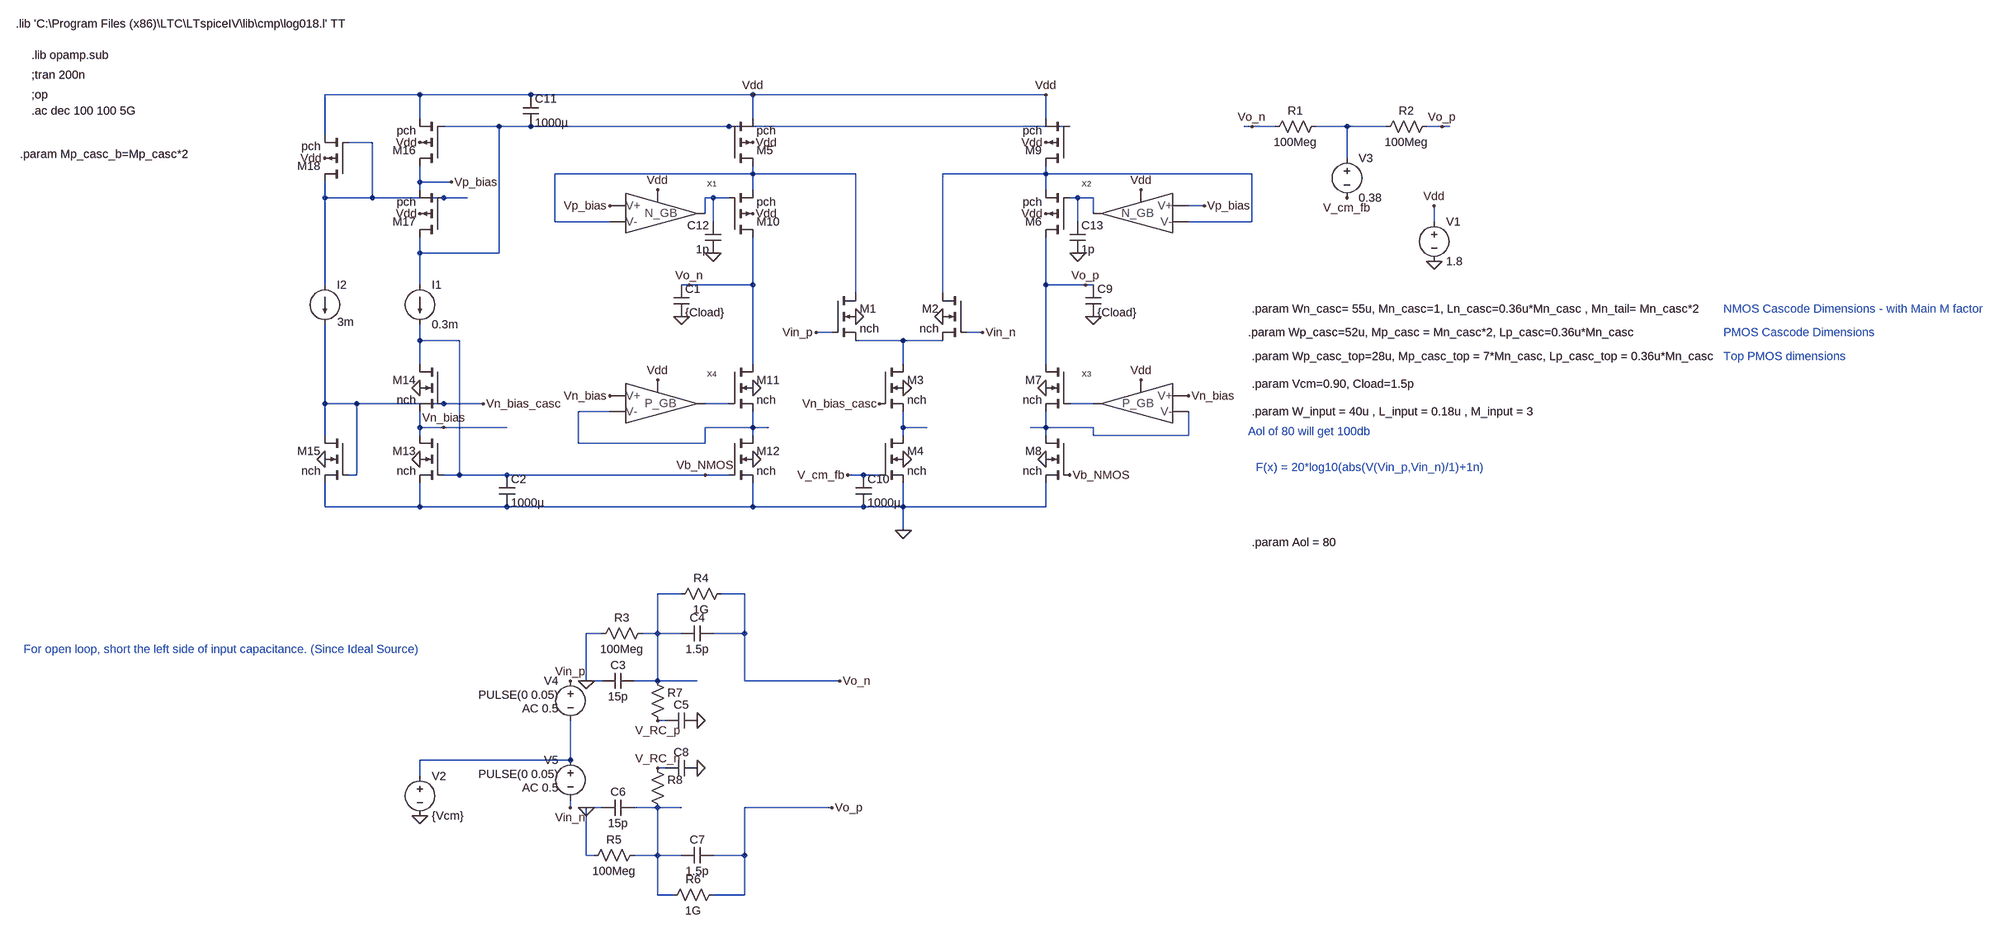
[diagram p0: schematic Discrete_Amplifier_10X.asc]
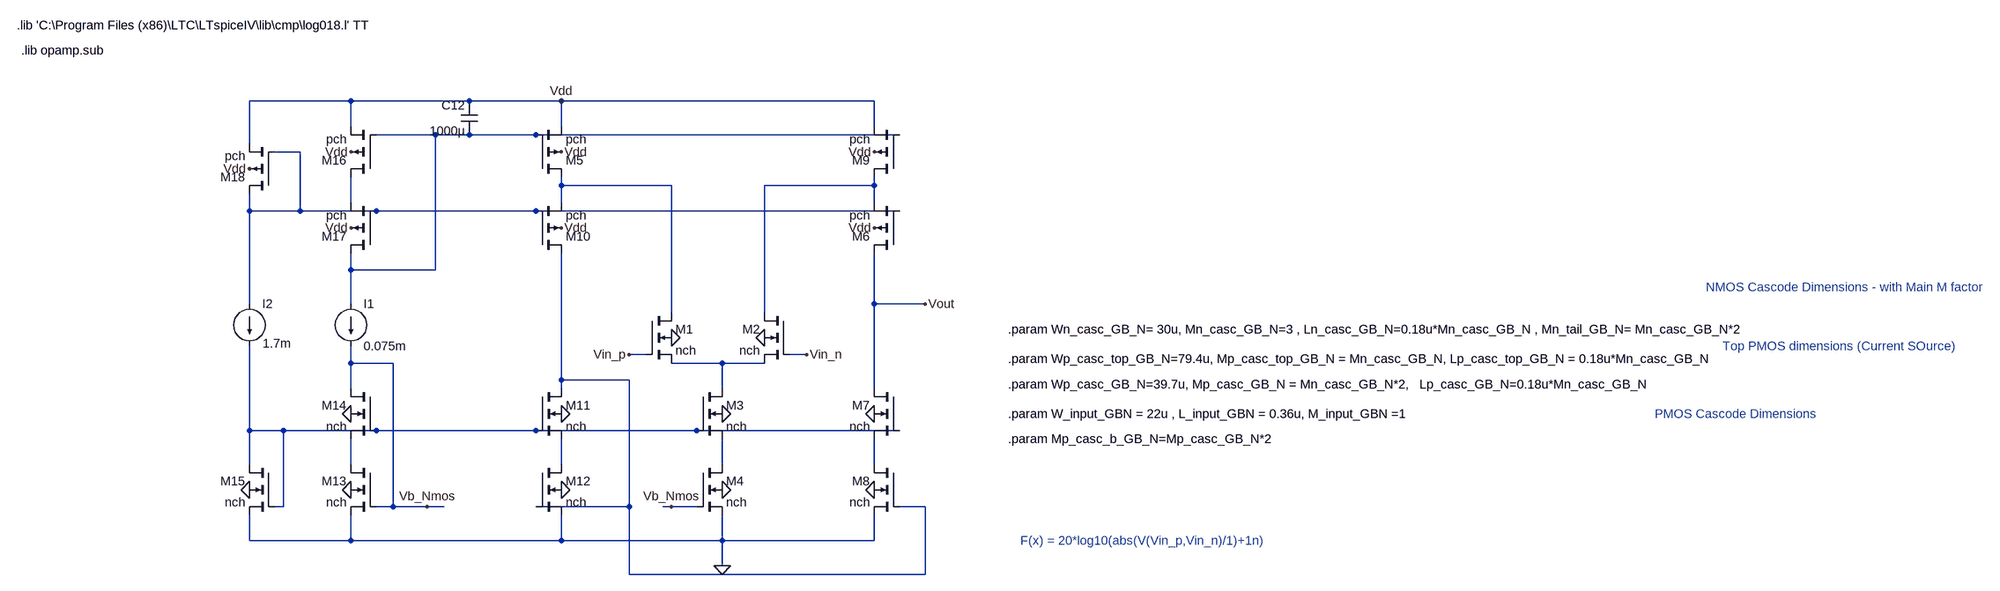
[diagram p1: sub-circuit gb-nmos.asc]
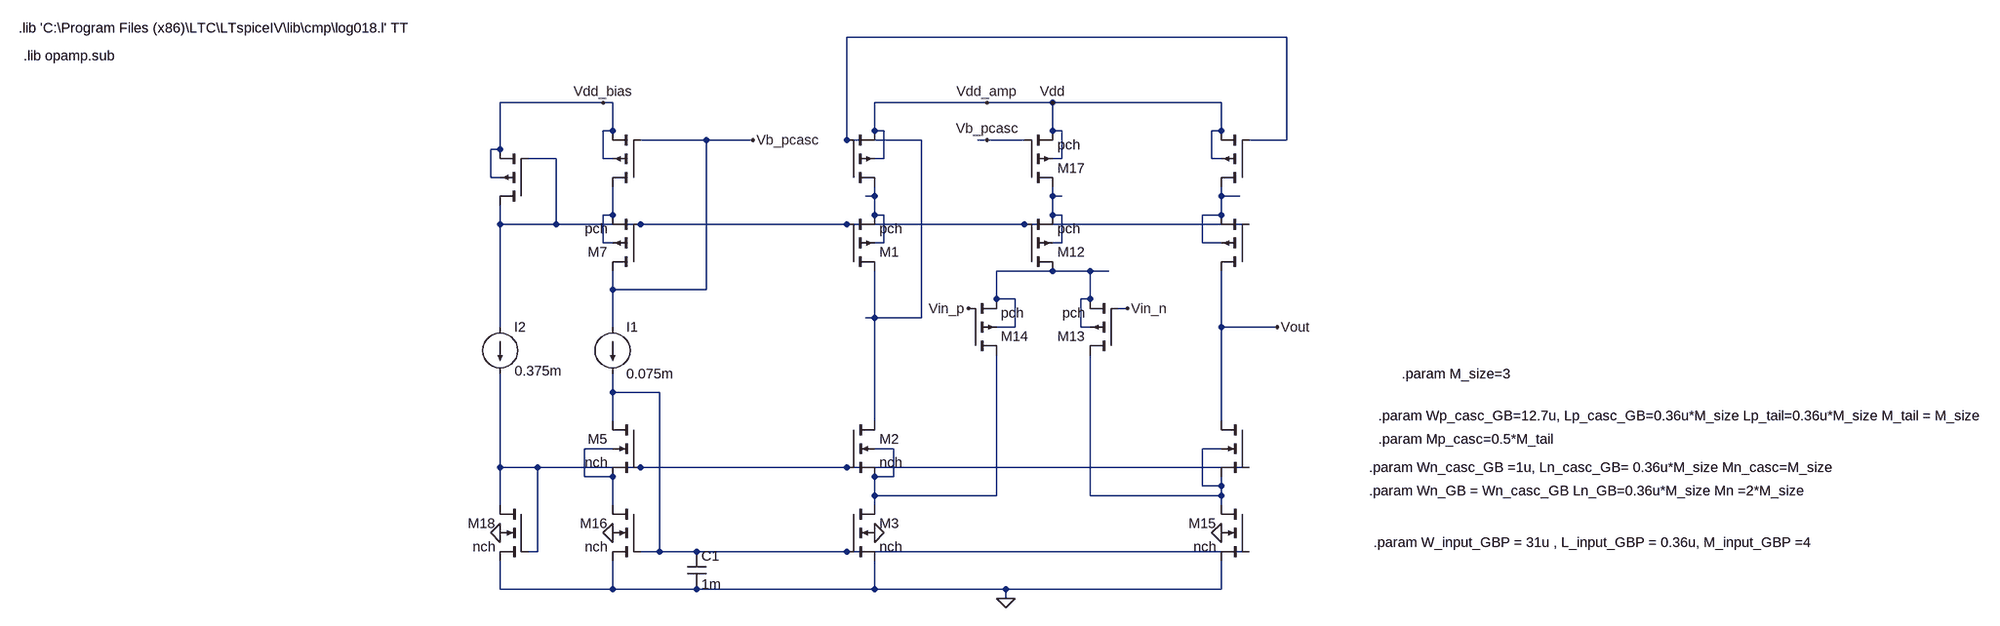
[diagram p2: sub-circuit gb-pmos.asc]
Discrete_Amplifier_10X.asc, the LTspice schematic file:
Version 4
SHEET 1 5520 2052
WIRE 208 -880 16 -880
WIRE 432 -880 208 -880
WIRE 880 -880 432 -880
WIRE 1376 -880 880 -880
WIRE 1472 -880 1376 -880
WIRE 208 -832 208 -880
WIRE 880 -832 880 -880
WIRE 1472 -832 1472 -880
WIRE 320 -816 256 -816
WIRE 368 -816 320 -816
WIRE 432 -816 368 -816
WIRE 832 -816 432 -816
WIRE 1520 -816 832 -816
WIRE 1888 -816 1872 -816
WIRE 1936 -816 1888 -816
WIRE 2064 -816 2016 -816
WIRE 2080 -816 2064 -816
WIRE 2160 -816 2080 -816
WIRE 2272 -816 2240 -816
WIRE 2288 -816 2272 -816
WIRE 16 -800 16 -880
WIRE 112 -784 64 -784
WIRE 2080 -752 2080 -816
WIRE 880 -720 880 -736
WIRE 880 -720 480 -720
WIRE 992 -720 880 -720
WIRE 1088 -720 992 -720
WIRE 1360 -720 1264 -720
WIRE 1472 -720 1472 -736
WIRE 1472 -720 1360 -720
WIRE 1888 -720 1472 -720
WIRE 208 -704 208 -736
WIRE 272 -704 208 -704
WIRE 208 -688 208 -704
WIRE 880 -688 880 -720
WIRE 1472 -688 1472 -720
WIRE 16 -672 16 -704
WIRE 112 -672 112 -784
WIRE 112 -672 16 -672
WIRE 256 -672 112 -672
WIRE 304 -672 256 -672
WIRE 800 -672 784 -672
WIRE 816 -672 800 -672
WIRE 832 -672 816 -672
WIRE 1536 -672 1520 -672
WIRE 1568 -672 1536 -672
WIRE 1792 -656 1760 -656
WIRE 784 -640 784 -672
WIRE 1568 -640 1568 -672
WIRE 480 -624 480 -720
WIRE 592 -624 480 -624
WIRE 800 -624 800 -672
WIRE 1536 -624 1536 -672
WIRE 1888 -624 1888 -720
WIRE 1888 -624 1760 -624
WIRE 2256 -624 2256 -656
WIRE 1088 -608 1088 -720
WIRE 1264 -608 1264 -720
WIRE 208 -560 208 -592
WIRE 368 -560 368 -816
WIRE 368 -560 208 -560
WIRE 880 -560 880 -592
WIRE 1472 -560 1472 -592
WIRE 16 -496 16 -672
WIRE 208 -496 208 -560
WIRE 752 -496 736 -496
WIRE 880 -496 880 -560
WIRE 880 -496 752 -496
WIRE 1472 -496 1472 -560
WIRE 1552 -496 1472 -496
WIRE 1568 -496 1552 -496
WIRE 1088 -480 1088 -608
WIRE 1264 -480 1264 -608
WIRE 1040 -400 1008 -400
WIRE 1344 -400 1312 -400
WIRE 208 -384 208 -416
WIRE 288 -384 208 -384
WIRE 1184 -384 1088 -384
WIRE 1264 -384 1184 -384
WIRE 208 -336 208 -384
WIRE 880 -336 880 -496
WIRE 1184 -336 1184 -384
WIRE 1472 -336 1472 -496
WIRE 16 -256 16 -416
WIRE 80 -256 16 -256
WIRE 256 -256 80 -256
WIRE 336 -256 256 -256
WIRE 832 -256 784 -256
WIRE 1568 -256 1520 -256
WIRE 592 -240 528 -240
WIRE 208 -208 208 -240
WIRE 256 -208 208 -208
WIRE 384 -208 256 -208
WIRE 880 -208 880 -240
WIRE 880 -208 784 -208
WIRE 912 -208 880 -208
WIRE 1184 -208 1184 -240
WIRE 1232 -208 1184 -208
WIRE 1472 -208 1472 -240
WIRE 1472 -208 1440 -208
WIRE 1568 -208 1472 -208
WIRE 16 -192 16 -256
WIRE 208 -192 208 -208
WIRE 880 -192 880 -208
WIRE 1184 -192 1184 -208
WIRE 1472 -192 1472 -208
WIRE 1568 -192 1568 -208
WIRE 1760 -192 1760 -240
WIRE 1760 -192 1568 -192
WIRE 528 -176 528 -240
WIRE 784 -176 784 -208
WIRE 784 -176 528 -176
WIRE 80 -112 80 -256
WIRE 80 -112 64 -112
WIRE 288 -112 288 -384
WIRE 288 -112 256 -112
WIRE 384 -112 288 -112
WIRE 784 -112 384 -112
WIRE 832 -112 784 -112
WIRE 1104 -112 1072 -112
WIRE 1136 -112 1104 -112
WIRE 16 -48 16 -96
WIRE 208 -48 208 -96
WIRE 208 -48 16 -48
WIRE 384 -48 208 -48
WIRE 880 -48 880 -96
WIRE 880 -48 384 -48
WIRE 1104 -48 880 -48
WIRE 1184 -48 1184 -96
WIRE 1184 -48 1104 -48
WIRE 1472 -48 1472 -96
WIRE 1472 -48 1184 -48
WIRE 1184 0 1184 -48
WIRE 736 128 688 128
WIRE 864 128 816 128
WIRE 576 208 544 208
WIRE 688 208 688 128
WIRE 688 208 656 208
WIRE 736 208 688 208
WIRE 864 208 864 128
WIRE 864 208 800 208
WIRE 544 304 544 208
WIRE 576 304 544 304
WIRE 688 304 688 208
WIRE 688 304 640 304
WIRE 768 304 688 304
WIRE 864 304 864 208
WIRE 1056 304 864 304
WIRE 704 384 688 384
WIRE 512 464 512 384
WIRE 512 464 208 464
WIRE 704 480 688 480
WIRE 208 496 208 464
WIRE 512 560 512 544
WIRE 576 560 544 560
WIRE 688 560 640 560
WIRE 736 560 688 560
WIRE 1040 560 864 560
WIRE 544 656 544 560
WIRE 560 656 544 656
WIRE 688 656 688 560
WIRE 688 656 640 656
WIRE 736 656 688 656
WIRE 864 656 864 560
WIRE 864 656 800 656
WIRE 688 736 688 656
WIRE 720 736 688 736
WIRE 864 736 864 656
WIRE 864 736 800 736
FLAG 1088 -432 0
FLAG 1184 -288 0
FLAG 1184 -144 0
FLAG 1184 0 0
FLAG 880 -288 0
FLAG 880 -144 0
FLAG 2256 -544 0
FLAG 2256 -656 Vdd
FLAG 880 -880 Vdd
FLAG 880 -640 Vdd
FLAG 880 -784 Vdd
FLAG 208 -144 0
FLAG 16 -144 0
FLAG 208 -288 0
FLAG 208 -784 Vdd
FLAG 208 -640 Vdd
FLAG 16 -752 Vdd
FLAG 1264 -432 0
FLAG 1472 -288 0
FLAG 1472 -144 0
FLAG 1472 -880 Vdd
FLAG 1472 -640 Vdd
FLAG 1472 -784 Vdd
FLAG 1072 -112 V_cm_fb
FLAG 1008 -400 Vin_p
FLAG 1344 -400 Vin_n
FLAG 208 576 0
FLAG 752 -496 Vo_n
FLAG 1552 -496 Vo_p
FLAG 2272 -816 Vo_p
FLAG 1888 -816 Vo_n
FLAG 1568 -432 0
FLAG 736 -432 0
FLAG 1056 304 Vo_n
FLAG 1040 560 Vo_p
FLAG 512 304 Vin_p
FLAG 512 560 Vin_n
FLAG 768 384 0
FLAG 768 480 0
FLAG 688 384 V_RC_p
FLAG 688 480 V_RC_n
FLAG 784 -112 Vb_NMOS
FLAG 1520 -112 Vb_NMOS
FLAG 2080 -672 V_cm_fb
FLAG 256 -208 Vn_bias
FLAG 336 -256 Vn_bias_casc
FLAG 1136 -256 Vn_bias_casc
FLAG 272 -704 Vp_bias
FLAG 688 -688 Vdd
FLAG 592 -656 Vp_bias
FLAG 1664 -688 Vdd
FLAG 1792 -656 Vp_bias
FLAG 592 -272 Vn_bias
FLAG 688 -304 Vdd
FLAG 1664 -304 Vdd
FLAG 1760 -272 Vn_bias
FLAG 544 304 0
FLAG 544 560 0
FLAG 800 -560 0
FLAG 1536 -560 0
DATAFLAG 912 -208 "round($*10k)/10k"
DATAFLAG 1184 -384 "round($*10k)/10k"
DATAFLAG 1232 -208 "round($*10k)/10k"
DATAFLAG 992 -720 "round($*100)/100"
DATAFLAG 1440 -208 "round($*10k)/10k"
DATAFLAG 1360 -720 "round($*100)/100"
DATAFLAG 1376 -880 "round($*1k)/1k"
DATAFLAG 1472 -560 "round($*1k)/1k"
DATAFLAG 1088 -608 "Id(M1)"
DATAFLAG 2064 -816 ""
DATAFLAG 320 -816 "round($*100)/100"
DATAFLAG 304 -672 "round($*10k)/10k"
DATAFLAG 384 -112 "round($*10k)/10k"
DATAFLAG 816 -368 "Id(M11)"
DATAFLAG 960 -832 "-Id(M5)"
DATAFLAG 1104 -208 "Id(M4)"
DATAFLAG 1104 -112 "round($*10k)/10k"
DATAFLAG 384 -208 "round($*10k)/10k"
DATAFLAG 208 -704 "round($*10k)/10k"
DATAFLAG 1264 -608 "Id(M1)"
DATAFLAG 816 -672 ""
DATAFLAG 1536 -672 ""
DATAFLAG 880 -560 "round($*1k)/1k"
SYMBOL nmos4 1040 -480 R0
SYMATTR InstName M1
SYMATTR Value nch
SYMATTR Value2 l={L_input} w={W_input} m={M_input}
SYMBOL nmos4 1136 -336 R0
SYMATTR InstName M3
SYMATTR Value nch
SYMATTR Value2 l={Ln_casc} w={Wn_casc} m={Mn_tail}
SYMBOL nmos4 1136 -192 R0
SYMATTR InstName M4
SYMATTR Value nch
SYMATTR Value2 l={Ln_casc} w={Wn_casc} m={Mn_tail}
SYMBOL pmos4 832 -592 M180
SYMATTR InstName M10
SYMATTR Value pch
SYMATTR Value2 l={Lp_casc} w={Wp_casc} m={Mp_casc}
SYMBOL nmos4 832 -336 R0
SYMATTR InstName M11
SYMATTR Value nch
SYMATTR Value2 l={Ln_casc} w={Wn_casc} m={Mn_casc}
SYMBOL nmos4 832 -192 R0
SYMATTR InstName M12
SYMATTR Value nch
SYMATTR Value2 l={Ln_casc} w={Wn_casc} m={Mn_casc}
SYMBOL voltage 2256 -640 R0
WINDOW 123 0 0 Left 2
WINDOW 39 0 0 Left 2
SYMATTR InstName V1
SYMATTR Value 1.8
SYMBOL pmos4 832 -736 M180
SYMATTR InstName M5
SYMATTR Value pch
SYMATTR Value2 l={Lp_casc_top} w={Wp_casc_top} m={Mp_casc_top}
SYMBOL res 2032 -832 R90
WINDOW 0 0 56 VBottom 2
WINDOW 3 32 56 VTop 2
SYMATTR InstName R1
SYMATTR Value 100Meg
SYMBOL res 2256 -832 R90
WINDOW 0 0 56 VBottom 2
WINDOW 3 32 56 VTop 2
SYMATTR InstName R2
SYMATTR Value 100Meg
SYMBOL nmos4 256 -192 M0
SYMATTR InstName M13
SYMATTR Value nch
SYMATTR Value2 l={Ln_casc} w={Wn_casc} m={Mn_tail}
SYMBOL current 208 -496 R0
WINDOW 123 0 0 Left 2
WINDOW 39 0 0 Left 2
SYMATTR InstName I1
SYMATTR Value 0.3m
SYMBOL nmos4 256 -336 M0
SYMATTR InstName M14
SYMATTR Value nch
SYMATTR Value2 l={Ln_casc} w={Wn_casc} m={Mn_tail}
SYMBOL current 16 -496 R0
WINDOW 123 0 0 Left 2
WINDOW 39 0 0 Left 2
WINDOW 3 25 75 Left 2
SYMATTR Value 3m
SYMATTR InstName I2
SYMBOL nmos4 64 -192 M0
SYMATTR InstName M15
SYMATTR Value nch
SYMATTR Value2 l={Ln_casc} w={Wn_casc} m={Mn_tail}
SYMBOL pmos4 256 -736 R180
SYMATTR InstName M16
SYMATTR Value pch
SYMATTR Value2 l={Lp_casc_top} w={Wp_casc_top} m={Mp_casc_top}
SYMBOL pmos4 256 -592 R180
SYMATTR InstName M17
SYMATTR Value pch
SYMATTR Value2 l={Lp_casc} w={Wp_casc} m={Mp_casc}
SYMBOL pmos4 64 -704 R180
SYMATTR InstName M18
SYMATTR Value pch
SYMATTR Value2 l={Lp_casc} w={Wp_casc} m={Mp_casc_b}
SYMBOL nmos4 1312 -480 M0
SYMATTR InstName M2
SYMATTR Value nch
SYMATTR Value2 l={L_input} w={W_input} m={M_input}
SYMBOL pmos4 1520 -592 R180
SYMATTR InstName M6
SYMATTR Value pch
SYMATTR Value2 l={Lp_casc} w={Wp_casc} m={Mp_casc}
SYMBOL nmos4 1520 -336 M0
SYMATTR InstName M7
SYMATTR Value nch
SYMATTR Value2 l={Ln_casc} w={Wn_Casc} m={Mn_casc}
SYMBOL nmos4 1520 -192 M0
SYMATTR InstName M8
SYMATTR Value nch
SYMATTR Value2 l={Ln_casc} w={Wn_Casc} m={Mn_casc}
SYMBOL pmos4 1520 -736 R180
SYMATTR InstName M9
SYMATTR Value pch
SYMATTR Value2 l={Lp_casc_top} w={Wp_casc_top} m={Mp_casc_top}
SYMBOL cap 368 -112 R0
SYMATTR InstName C2
SYMATTR Value 1000µ
SYMBOL cap 640 288 R90
WINDOW 0 0 32 VBottom 2
WINDOW 3 32 32 VTop 2
SYMATTR InstName C3
SYMATTR Value 15p
SYMBOL cap 800 192 R90
WINDOW 0 0 32 VBottom 2
WINDOW 3 32 32 VTop 2
SYMATTR InstName C4
SYMATTR Value 1.5p
SYMBOL cap 640 576 M270
WINDOW 0 32 32 VTop 2
WINDOW 3 0 32 VBottom 2
SYMATTR InstName C6
SYMATTR Value 15p
SYMBOL cap 800 672 M270
WINDOW 0 32 32 VTop 2
WINDOW 3 0 32 VBottom 2
SYMATTR InstName C7
SYMATTR Value 1.5p
SYMBOL voltage 208 480 R0
WINDOW 123 0 0 Left 2
WINDOW 39 0 0 Left 2
SYMATTR InstName V2
SYMATTR Value {Vcm}
SYMBOL voltage 512 288 M0
WINDOW 3 24 44 Left 2
WINDOW 123 24 72 Left 2
WINDOW 39 0 0 Left 2
SYMATTR Value PULSE(0 0.05)
SYMATTR Value2 AC 0.5
SYMATTR InstName V4
SYMBOL voltage 512 448 M0
WINDOW 3 24 44 Left 2
WINDOW 123 24 72 Left 2
WINDOW 39 0 0 Left 2
SYMATTR Value PULSE(0 0.05)
SYMATTR Value2 AC 0.5
SYMATTR InstName V5
SYMBOL res 672 192 R90
WINDOW 0 0 56 VBottom 2
WINDOW 3 32 56 VTop 2
SYMATTR InstName R3
SYMATTR Value 100Meg
SYMBOL res 832 112 R90
WINDOW 0 0 56 VBottom 2
WINDOW 3 32 56 VTop 2
SYMATTR InstName R4
SYMATTR Value 1G
SYMBOL res 656 640 R90
WINDOW 0 0 56 VBottom 2
WINDOW 3 32 56 VTop 2
SYMATTR InstName R5
SYMATTR Value 100Meg
SYMBOL res 816 720 R90
WINDOW 0 0 56 VBottom 2
WINDOW 3 32 56 VTop 2
SYMATTR InstName R6
SYMATTR Value 1G
SYMBOL cap 720 -496 R0
SYMATTR InstName C1
SYMATTR Value {Cload}
SYMBOL cap 1552 -496 R0
SYMATTR InstName C9
SYMATTR Value {Cload}
SYMBOL res 672 288 R0
WINDOW 3 151 69 Invisible 2
SYMATTR Value 10Meg
SYMATTR InstName R7
SYMBOL res 672 464 R0
WINDOW 3 36 76 Invisible 2
SYMATTR Value 10Meg
SYMATTR InstName R8
SYMBOL cap 768 368 R90
WINDOW 0 0 32 VBottom 2
WINDOW 3 32 32 Invisible 2
SYMATTR InstName C5
SYMATTR Value 1000µ
SYMBOL cap 704 496 R270
WINDOW 0 32 32 VTop 2
WINDOW 3 0 32 Invisible 2
SYMATTR InstName C8
SYMATTR Value 1000µ
SYMBOL cap 1088 -112 R0
SYMATTR InstName C10
SYMATTR Value 1000µ
SYMBOL voltage 2080 -768 R0
WINDOW 123 0 0 Left 2
WINDOW 39 0 0 Left 2
SYMATTR InstName V3
SYMATTR Value 0.38
SYMBOL cap 416 -880 R0
SYMATTR InstName C11
SYMATTR Value 1000µ
SYMBOL GB-NMOS 688 -640 R0
SYMATTR InstName X1
SYMBOL GB-NMOS 1664 -640 M0
SYMATTR InstName X2
SYMBOL GB-PMOS 1664 -256 M0
SYMATTR InstName X3
SYMBOL GB-PMOS 688 -256 R0
SYMATTR InstName X4
SYMBOL cap 816 -560 R180
WINDOW 0 24 56 Left 2
WINDOW 3 24 8 Left 2
SYMATTR InstName C12
SYMATTR Value 1p
SYMBOL cap 1520 -624 R0
SYMATTR InstName C13
SYMATTR Value 1p
TEXT -608 -1024 Left 2 !.lib 'C:\\Program Files (x86)\\LTC\\LTspiceIV\\lib\\cmp\\log018.l' TT
TEXT -576 -920 Left 2 !;tran 200n
TEXT -576 -960 Left 2 !.lib opamp.sub
TEXT -576 -880 Left 2 !;op
TEXT -576 -848 Left 2 !.ac dec 100 100 5G
TEXT 1888 -448 Left 2 !.param Wn_casc= 55u, Mn_casc=1, Ln_casc=0.36u*Mn_casc , Mn_tail= Mn_casc*2
TEXT 1880 -400 Left 2 !.param Wp_casc=52u, Mp_casc = Mn_casc*2, Lp_casc=0.36u*Mn_casc
TEXT 1888 -352 Left 2 !.param Wp_casc_top=28u, Mp_casc_top = 7*Mn_casc, Lp_casc_top = 0.36u*Mn_casc
TEXT 1888 -296 Left 2 !.param Vcm=0.90, Cload=1.5p
TEXT 1896 -128 Left 2 ;F(x) = 20*log10(abs(V(Vin_p,Vin_n)/1)+1n)
TEXT 2840 -352 Left 2 ;Top PMOS dimensions
TEXT 2840 -400 Left 2 ;PMOS Cascode Dimensions
TEXT 2840 -448 Left 2 ;NMOS Cascode Dimensions - with Main M factor
TEXT -600 -760 Left 2 !.param Mp_casc_b=Mp_casc*2
TEXT 1888 24 Left 2 !.param Aol = 80
TEXT -592 240 Left 2 ;For open loop, short the left side of input capacitance. (Since Ideal Source)
TEXT 1880 -200 Left 2 ;Aol of 80 will get 100db
TEXT 1888 -240 Left 2 !.param W_input = 40u , L_input = 0.18u , M_input = 3

gb-nmos.asc, the sub-circuit schematic file:
Version 4
SHEET 1 3836 784
WIRE 432 -880 240 -880
WIRE 656 -880 432 -880
WIRE 880 -880 656 -880
WIRE 1376 -880 880 -880
WIRE 1472 -880 1376 -880
WIRE 880 -848 880 -880
WIRE 432 -832 432 -880
WIRE 880 -832 880 -848
WIRE 1472 -832 1472 -880
WIRE 592 -816 480 -816
WIRE 656 -816 592 -816
WIRE 832 -816 656 -816
WIRE 1520 -816 832 -816
WIRE 240 -800 240 -880
WIRE 336 -784 288 -784
WIRE 880 -720 880 -736
WIRE 1088 -720 880 -720
WIRE 1472 -720 1472 -736
WIRE 1472 -720 1264 -720
WIRE 432 -688 432 -736
WIRE 880 -688 880 -720
WIRE 1472 -688 1472 -720
WIRE 240 -672 240 -704
WIRE 336 -672 336 -784
WIRE 336 -672 240 -672
WIRE 480 -672 336 -672
WIRE 704 -672 480 -672
WIRE 832 -672 704 -672
WIRE 1520 -672 832 -672
WIRE 432 -560 432 -592
WIRE 592 -560 592 -816
WIRE 592 -560 432 -560
WIRE 1472 -560 1472 -592
WIRE 240 -496 240 -672
WIRE 432 -496 432 -560
WIRE 1472 -496 1472 -560
WIRE 1568 -496 1472 -496
WIRE 1088 -480 1088 -720
WIRE 1264 -480 1264 -720
WIRE 880 -464 880 -592
WIRE 1040 -400 1008 -400
WIRE 1344 -400 1312 -400
WIRE 432 -384 432 -416
WIRE 512 -384 432 -384
WIRE 1184 -384 1088 -384
WIRE 1264 -384 1184 -384
WIRE 880 -352 880 -464
WIRE 1008 -352 880 -352
WIRE 432 -336 432 -384
WIRE 880 -336 880 -352
WIRE 1184 -336 1184 -384
WIRE 1472 -336 1472 -496
WIRE 240 -256 240 -416
WIRE 304 -256 240 -256
WIRE 480 -256 304 -256
WIRE 832 -256 480 -256
WIRE 1136 -256 832 -256
WIRE 1360 -256 1136 -256
WIRE 1520 -256 1360 -256
WIRE 240 -192 240 -256
WIRE 432 -192 432 -240
WIRE 880 -192 880 -240
WIRE 1184 -192 1184 -240
WIRE 1472 -192 1472 -240
WIRE 304 -112 304 -256
WIRE 304 -112 288 -112
WIRE 512 -112 512 -384
WIRE 512 -112 480 -112
WIRE 576 -112 512 -112
WIRE 608 -112 576 -112
WIRE 1008 -112 1008 -352
WIRE 1008 -112 832 -112
WIRE 1088 -112 1072 -112
WIRE 1136 -112 1088 -112
WIRE 1568 -112 1520 -112
WIRE 240 -48 240 -96
WIRE 432 -48 432 -96
WIRE 432 -48 240 -48
WIRE 880 -48 880 -96
WIRE 880 -48 432 -48
WIRE 1184 -48 1184 -96
WIRE 1184 -48 880 -48
WIRE 1472 -48 1472 -96
WIRE 1472 -48 1184 -48
WIRE 1184 0 1184 -48
WIRE 1008 16 1008 -112
WIRE 1456 16 1008 16
WIRE 1568 16 1568 -112
WIRE 1568 16 1456 16
FLAG 1088 -432 0
FLAG 1184 -288 0
FLAG 1184 -144 0
FLAG 1184 0 0
FLAG 880 -288 0
FLAG 880 -144 0
FLAG 880 -880 Vdd
FLAG 880 -640 Vdd
FLAG 880 -784 Vdd
FLAG 432 -144 0
FLAG 240 -144 0
FLAG 432 -288 0
FLAG 432 -784 Vdd
FLAG 432 -640 Vdd
FLAG 240 -752 Vdd
FLAG 1264 -432 0
FLAG 1472 -288 0
FLAG 1472 -144 0
FLAG 1472 -640 Vdd
FLAG 1472 -784 Vdd
FLAG 1008 -400 Vin_p
FLAG 1344 -400 Vin_n
FLAG 576 -112 Vb_Nmos
FLAG 1088 -112 Vb_Nmos
FLAG 1568 -496 Vout
DATAFLAG 1184 -384 "round($*10k)/10k"
DATAFLAG 1376 -880 "round($*1k)/1k"
DATAFLAG 1472 -560 "round($*1k)/1k"
DATAFLAG 704 -672 ""
DATAFLAG 1360 -256 ""
DATAFLAG 1456 16 ""
DATAFLAG 880 -848 "-Id(x1:M5)"
DATAFLAG 880 -464 "-Id(x1:M10)"
DATAFLAG 1168 -608 "Id(x2:M1)"
DATAFLAG 1168 -560 "Id(x1:M1)"
SYMBOL nmos4 1040 -480 R0
SYMATTR InstName M1
SYMATTR Value nch
SYMATTR Value2 l={L_input_GBN} w={W_input_GBN} m={M_input_GBN}
SYMBOL nmos4 1136 -336 R0
SYMATTR InstName M3
SYMATTR Value nch
SYMATTR Value2 l={Ln_casc_GB_N} w={Wn_casc_GB_N} m={Mn_tail_GB_N}
SYMBOL nmos4 1136 -192 R0
SYMATTR InstName M4
SYMATTR Value nch
SYMATTR Value2 l={Ln_casc_GB_N} w={Wn_casc_GB_N} m={Mn_tail_GB_N}
SYMBOL pmos4 832 -592 M180
SYMATTR InstName M10
SYMATTR Value pch
SYMATTR Value2 l={Lp_casc_GB_N} w={Wp_casc_GB_N} m={Mp_casc_GB_N}
SYMBOL nmos4 832 -336 R0
SYMATTR InstName M11
SYMATTR Value nch
SYMATTR Value2 l={Ln_casc_GB_N} w={Wn_casc_GB_N} m={Mn_casc_GB_N}
SYMBOL nmos4 832 -192 R0
SYMATTR InstName M12
SYMATTR Value nch
SYMATTR Value2 l={Ln_casc_GB_N} w={Wn_casc_GB_N} m={Mn_casc_GB_N}
SYMBOL pmos4 832 -736 M180
SYMATTR InstName M5
SYMATTR Value pch
SYMATTR Value2 l={Lp_casc_top_GB_N} w={Wp_casc_top_GB_N} m={Mp_casc_top_GB_N}
SYMBOL nmos4 480 -192 M0
SYMATTR InstName M13
SYMATTR Value nch
SYMATTR Value2 l={Ln_casc_GB_N} w={Wn_casc_GB_N} m={Mn_tail_GB_N}
SYMBOL current 432 -496 R0
WINDOW 123 0 0 Left 2
WINDOW 39 0 0 Left 2
SYMATTR InstName I1
SYMATTR Value 0.075m
SYMBOL nmos4 480 -336 M0
SYMATTR InstName M14
SYMATTR Value nch
SYMATTR Value2 l={Ln_casc_GB_N} w={Wn_casc_GB_N} m={Mn_tail_GB_N}
SYMBOL current 240 -496 R0
WINDOW 123 0 0 Left 2
WINDOW 39 0 0 Left 2
WINDOW 3 25 75 Left 2
SYMATTR Value 1.7m
SYMATTR InstName I2
SYMBOL nmos4 288 -192 M0
SYMATTR InstName M15
SYMATTR Value nch
SYMATTR Value2 l={Ln_casc_GB_N} w={Wn_casc_GB_N} m={Mn_tail_GB_N}
SYMBOL pmos4 480 -736 R180
SYMATTR InstName M16
SYMATTR Value pch
SYMATTR Value2 l={Lp_casc_top_GB_N} w={Wp_casc_top_GB_N} m={Mp_casc_top_GB_N}
SYMBOL pmos4 480 -592 R180
SYMATTR InstName M17
SYMATTR Value pch
SYMATTR Value2 l={Lp_casc_GB_N} w={Wp_casc_GB_N} m={Mp_casc_GB_N}
SYMBOL pmos4 288 -704 R180
SYMATTR InstName M18
SYMATTR Value pch
SYMATTR Value2 l={Lp_casc_GB_N} w={Wp_casc_GB_N} m={Mp_casc_b_GB_N}
SYMBOL nmos4 1312 -480 M0
SYMATTR InstName M2
SYMATTR Value nch
SYMATTR Value2 l={L_input_GBN} w={W_input_GBN} m={M_input_GBN}
SYMBOL pmos4 1520 -592 R180
SYMATTR InstName M6
SYMATTR Value pch
SYMATTR Value2 l={Lp_casc_GB_N} w={Wp_casc_GB_N} m={Mp_casc_GB_N}
SYMBOL nmos4 1520 -336 M0
SYMATTR InstName M7
SYMATTR Value nch
SYMATTR Value2 l={Ln_casc_GB_N} w={Wn_Casc_GB_N} m={Mn_casc_GB_N}
SYMBOL nmos4 1520 -192 M0
SYMATTR InstName M8
SYMATTR Value nch
SYMATTR Value2 l={Ln_casc_GB_N} w={Wn_Casc_GB_N} m={Mn_casc_GB_N}
SYMBOL pmos4 1520 -736 R180
SYMATTR InstName M9
SYMATTR Value pch
SYMATTR Value2 l={Lp_casc_top_GB_N} w={Wp_casc_top_GB_N} m={Mp_casc_top_GB_N}
SYMBOL cap 672 -816 R180
WINDOW 0 24 56 Left 2
WINDOW 3 24 8 Left 2
SYMATTR InstName C12
SYMATTR Value 1000µ
TEXT -200 -1024 Left 2 !.lib 'C:\\Program Files (x86)\\LTC\\LTspiceIV\\lib\\cmp\\log018.l' TT
TEXT -192 -976 Left 2 !.lib opamp.sub
TEXT 1888 -448 Left 2 !.param Wn_casc_GB_N= 30u, Mn_casc_GB_N=3 , Ln_casc_GB_N=0.18u*Mn_casc_GB_N , Mn_tail_GB_N= Mn_casc_GB_N*2
TEXT 1888 -344 Left 2 !.param Wp_casc_GB_N=39.7u, Mp_casc_GB_N = Mn_casc_GB_N*2,   Lp_casc_GB_N=0.18u*Mn_casc_GB_N
TEXT 1888 -392 Left 2 !.param Wp_casc_top_GB_N=79.4u, Mp_casc_top_GB_N = Mn_casc_GB_N, Lp_casc_top_GB_N = 0.18u*Mn_casc_GB_N
TEXT 1912 -48 Left 2 ;F(x) = 20*log10(abs(V(Vin_p,Vin_n)/1)+1n)
TEXT 3240 -416 Left 2 ;Top PMOS dimensions (Current SOurce)
TEXT 3112 -288 Left 2 ;PMOS Cascode Dimensions
TEXT 3208 -528 Left 2 ;NMOS Cascode Dimensions - with Main M factor
TEXT 1888 -240 Left 2 !.param Mp_casc_b_GB_N=Mp_casc_GB_N*2
TEXT 1888 -288 Left 2 !.param W_input_GBN = 22u , L_input_GBN = 0.36u, M_input_GBN =1

gb-pmos.asc, the sub-circuit schematic file:
Version 4
SHEET 1 3836 784
WIRE 2000 -1008 1248 -1008
WIRE 832 -896 656 -896
WIRE 848 -896 832 -896
WIRE 1488 -896 1296 -896
WIRE 1600 -896 1488 -896
WIRE 1792 -896 1600 -896
WIRE 1888 -896 1792 -896
WIRE 848 -848 848 -896
WIRE 848 -848 832 -848
WIRE 1296 -848 1296 -896
WIRE 1312 -848 1296 -848
WIRE 1600 -848 1600 -896
WIRE 1616 -848 1600 -848
WIRE 1888 -848 1888 -896
WIRE 1888 -848 1872 -848
WIRE 976 -832 896 -832
WIRE 1008 -832 976 -832
WIRE 1088 -832 1008 -832
WIRE 1248 -832 1248 -1008
WIRE 1376 -832 1248 -832
WIRE 1488 -832 1472 -832
WIRE 1552 -832 1488 -832
WIRE 2000 -832 2000 -1008
WIRE 2000 -832 1936 -832
WIRE 656 -816 656 -896
WIRE 656 -816 640 -816
WIRE 752 -800 704 -800
WIRE 832 -800 832 -848
WIRE 848 -800 832 -800
WIRE 1312 -800 1312 -848
WIRE 1312 -800 1296 -800
WIRE 1616 -800 1616 -848
WIRE 1616 -800 1600 -800
WIRE 1872 -800 1872 -848
WIRE 1888 -800 1872 -800
WIRE 640 -768 640 -816
WIRE 656 -768 640 -768
WIRE 1296 -736 1296 -752
WIRE 1296 -736 1280 -736
WIRE 1600 -736 1600 -752
WIRE 1616 -736 1600 -736
WIRE 1888 -736 1888 -752
WIRE 1920 -736 1888 -736
WIRE 848 -704 848 -752
WIRE 848 -704 832 -704
WIRE 1296 -704 1296 -736
WIRE 1312 -704 1296 -704
WIRE 1600 -704 1600 -736
WIRE 1616 -704 1600 -704
WIRE 1888 -704 1888 -736
WIRE 1888 -704 1856 -704
WIRE 656 -688 656 -720
WIRE 752 -688 752 -800
WIRE 752 -688 656 -688
WIRE 896 -688 752 -688
WIRE 1104 -688 896 -688
WIRE 1248 -688 1104 -688
WIRE 1552 -688 1248 -688
WIRE 1936 -688 1552 -688
WIRE 832 -656 832 -704
WIRE 848 -656 832 -656
WIRE 1312 -656 1312 -704
WIRE 1312 -656 1296 -656
WIRE 1616 -656 1616 -704
WIRE 1616 -656 1600 -656
WIRE 1856 -656 1856 -704
WIRE 1888 -656 1856 -656
WIRE 1600 -608 1504 -608
WIRE 1664 -608 1600 -608
WIRE 1696 -608 1664 -608
WIRE 848 -576 848 -608
WIRE 1008 -576 1008 -832
WIRE 1008 -576 848 -576
WIRE 1504 -560 1504 -608
WIRE 1536 -560 1504 -560
WIRE 1664 -560 1664 -608
WIRE 1664 -560 1648 -560
WIRE 1728 -544 1712 -544
WIRE 1296 -528 1296 -608
WIRE 1296 -528 1280 -528
WIRE 1376 -528 1376 -832
WIRE 1376 -528 1296 -528
WIRE 656 -512 656 -688
WIRE 848 -512 848 -576
WIRE 1536 -512 1536 -560
WIRE 1536 -512 1504 -512
WIRE 1648 -512 1648 -560
WIRE 1664 -512 1648 -512
WIRE 1888 -512 1888 -608
WIRE 1952 -512 1888 -512
WIRE 1984 -512 1952 -512
WIRE 1296 -416 1296 -528
WIRE 1504 -416 1504 -464
WIRE 1664 -416 1664 -464
WIRE 1888 -416 1888 -512
WIRE 848 -400 848 -432
WIRE 928 -400 848 -400
WIRE 848 -352 848 -400
WIRE 1296 -352 1296 -416
WIRE 1888 -352 1888 -416
WIRE 848 -304 800 -304
WIRE 1328 -304 1296 -304
WIRE 1888 -304 1856 -304
WIRE 656 -272 656 -432
WIRE 720 -272 656 -272
WIRE 896 -272 720 -272
WIRE 1056 -272 896 -272
WIRE 1248 -272 1056 -272
WIRE 1936 -272 1248 -272
WIRE 800 -256 800 -304
WIRE 848 -256 800 -256
WIRE 1328 -256 1328 -304
WIRE 1328 -256 1296 -256
WIRE 1856 -240 1856 -304
WIRE 1888 -240 1888 -256
WIRE 1888 -240 1856 -240
WIRE 1296 -224 1296 -256
WIRE 1376 -224 1296 -224
WIRE 1504 -224 1504 -416
WIRE 1504 -224 1376 -224
WIRE 1664 -224 1664 -416
WIRE 1808 -224 1664 -224
WIRE 1888 -224 1888 -240
WIRE 1888 -224 1808 -224
WIRE 656 -208 656 -272
WIRE 848 -208 848 -256
WIRE 1296 -208 1296 -224
WIRE 1888 -208 1888 -224
WIRE 720 -128 720 -272
WIRE 720 -128 704 -128
WIRE 928 -128 928 -400
WIRE 928 -128 896 -128
WIRE 992 -128 928 -128
WIRE 1088 -128 992 -128
WIRE 1248 -128 1088 -128
WIRE 1936 -128 1248 -128
WIRE 656 -64 656 -112
WIRE 848 -64 848 -112
WIRE 848 -64 656 -64
WIRE 992 -64 848 -64
WIRE 1296 -64 1296 -112
WIRE 1296 -64 992 -64
WIRE 1520 -64 1296 -64
WIRE 1888 -64 1888 -112
WIRE 1888 -64 1520 -64
WIRE 1520 -48 1520 -64
FLAG 1296 -160 0
FLAG 1488 -896 Vdd_amp
FLAG 848 -160 0
FLAG 656 -160 0
FLAG 1888 -160 0
FLAG 1520 -48 0
FLAG 1984 -512 Vout
FLAG 1456 -544 Vin_p
FLAG 1728 -544 Vin_n
FLAG 1088 -832 Vb_pcasc
FLAG 1488 -832 Vb_pcasc
FLAG 832 -896 Vdd_bias
FLAG 1600 -896 Vdd
DATAFLAG 1376 -224 "round($*10k)/10k"
DATAFLAG 1808 -224 "round($*10k)/10k"
DATAFLAG 1792 -896 "round($*1k)/1k"
DATAFLAG 1664 -416 "round(-Id(x6:x3:M3)*10000000)/10000000"
DATAFLAG 1616 -736 "round($*100)/100"
DATAFLAG 1920 -736 "round($*100)/100"
DATAFLAG 1280 -736 "round($*100)/100"
DATAFLAG 1104 -688 "round($*100)/100"
DATAFLAG 976 -832 "round($*100)/100"
DATAFLAG 1056 -272 "round($*100)/100"
DATAFLAG 1088 -128 "round($*100)/100"
DATAFLAG 1280 -528 "round($*100)/100"
DATAFLAG 1952 -512 "round($*100)/100"
DATAFLAG 1696 -608 "round($*100)/100"
DATAFLAG 1296 -416 "round(Id(M11)*10000K)/10000K"
DATAFLAG 1888 -416 "round(Id(x6:x3:M7)*10000000)/10000000"
DATAFLAG 1504 -416 "round(Id(M18)*10000K)/10000K"
SYMBOL pmos4 1248 -608 M180
SYMATTR InstName M1
SYMATTR Value pch
SYMATTR Value2 l={Lp_casc_GB} w={Wp_casc_GB} m={Mp_casc}
SYMBOL nmos4 1248 -352 R0
SYMATTR InstName M2
SYMATTR Value nch
SYMATTR Value2 l={Ln_casc_GB} w={Wn_casc_GB} m={Mn_casc}
SYMBOL nmos4 1248 -208 R0
SYMATTR InstName M3
SYMATTR Value nch
SYMATTR Value2 l={Ln_casc_GB} w={Wn_GB} m={Mn}
SYMBOL pmos4 1248 -752 M180
WINDOW 0 56 32 Invisible 2
WINDOW 3 56 72 Invisible 2
SYMATTR InstName M4
SYMATTR Value pch
SYMATTR Value2 l={Lp_casc_GB} w={Wp_casc_GB} m={Mp_casc}
SYMBOL current 848 -512 R0
WINDOW 123 0 0 Left 2
WINDOW 39 0 0 Left 2
SYMATTR InstName I1
SYMATTR Value 0.075m
SYMBOL nmos4 896 -352 M0
SYMATTR InstName M5
SYMATTR Value nch
SYMATTR Value2 l={Ln_casc_GB} w={Wn_casc_GB} m={Mn_casc}
SYMBOL current 656 -512 R0
WINDOW 123 0 0 Left 2
WINDOW 39 0 0 Left 2
WINDOW 3 25 75 Left 2
SYMATTR Value 0.375m
SYMATTR InstName I2
SYMBOL pmos4 896 -752 R180
WINDOW 0 56 32 Invisible 2
WINDOW 3 56 72 Invisible 2
SYMATTR InstName M6
SYMATTR Value pch
SYMATTR Value2 l={Lp_casc_GB} w={Wp_casc_GB} m={M_tail}
SYMBOL pmos4 896 -608 R180
SYMATTR InstName M7
SYMATTR Value pch
SYMATTR Value2 l={Lp_casc_GB} w={Wp_casc_GB} m={M_tail}
SYMBOL pmos4 704 -720 R180
WINDOW 0 56 32 Invisible 2
WINDOW 3 56 72 Invisible 2
SYMATTR InstName M8
SYMATTR Value pch
SYMATTR Value2 l={Lp_casc_GB} w={Wp_casc_GB} m={M_tail}
SYMBOL pmos4 1936 -608 R180
WINDOW 0 56 32 Invisible 2
WINDOW 3 56 72 Invisible 2
SYMATTR InstName M9
SYMATTR Value pch
SYMATTR Value2 l={Lp_casc_GB} w={Wp_casc_GB} m={Mp_casc}
SYMBOL nmos4 1936 -352 M0
WINDOW 0 56 32 Invisible 2
WINDOW 3 56 72 Invisible 2
SYMATTR InstName M10
SYMATTR Value nch
SYMATTR Value2 l={Ln_casc_GB} w={Wn_casc_GB} m={Mn_casc}
SYMBOL pmos4 1936 -752 R180
WINDOW 0 56 32 Invisible 2
WINDOW 3 56 72 Invisible 2
SYMATTR InstName M11
SYMATTR Value pch
SYMATTR Value2 l={Lp_casc_GB} w={Wp_casc_GB} m={Mp_casc}
SYMBOL pmos4 1552 -608 M180
SYMATTR InstName M12
SYMATTR Value pch
SYMATTR Value2 l={Lp_tail} w={Wp_casc_GB} m={M_tail}
SYMBOL pmos4 1712 -464 R180
SYMATTR InstName M13
SYMATTR Value pch
SYMATTR Value2 l={L_input_GBP} w={W_input_GBP} m={M_input_GBP}
SYMBOL pmos4 1456 -464 M180
SYMATTR InstName M14
SYMATTR Value pch
SYMATTR Value2 l={L_input_GBP} w={W_input_GBP} m={M_input_GBP}
SYMBOL cap 976 -128 R0
SYMATTR InstName C1
SYMATTR Value 1m
SYMBOL nmos4 1936 -208 M0
SYMATTR InstName M15
SYMATTR Value nch
SYMATTR Value2 l={Ln_casc_GB} w={Wn_GB} m={Mn}
SYMBOL nmos4 896 -208 M0
SYMATTR InstName M16
SYMATTR Value nch
SYMATTR Value2 l={Ln_casc_GB} w={Wn_GB} m={Mn}
SYMBOL pmos4 1552 -752 M180
SYMATTR InstName M17
SYMATTR Value pch
SYMATTR Value2 l={Lp_tail} w={Wp_casc_GB} m={M_tail}
SYMBOL nmos4 704 -208 M0
SYMATTR InstName M18
SYMATTR Value nch
SYMATTR Value2 l={Ln_casc_GB} w={Wn_GB} m={Mn}
TEXT -200 -1024 Left 2 !.lib 'C:\\Program Files (x86)\\LTC\\LTspiceIV\\lib\\cmp\\log018.l' TT
TEXT -192 -976 Left 2 !.lib opamp.sub
TEXT 2160 -360 Left 2 !.param Wp_casc_GB=12.7u, Lp_casc_GB=0.36u*M_size Lp_tail=0.36u*M_size M_tail = M_size
TEXT 2144 -272 Left 2 !.param Wn_casc_GB =1u, Ln_casc_GB= 0.36u*M_size Mn_casc=M_size
TEXT 2144 -232 Left 2 !.param Wn_GB = Wn_casc_GB Ln_GB=0.36u*M_size Mn =2*M_size
TEXT 2152 -144 Left 2 !.param W_input_GBP = 31u , L_input_GBP = 0.36u, M_input_GBP =4
TEXT 2200 -432 Left 2 !.param M_size=3
TEXT 2160 -320 Left 2 !.param Mp_casc=0.5*M_tail

The netlist it stands for:
* Discrete_Amplifier_10X.asc
M1 N004 Vin_p N008 0 nch l={L_input} w={W_input} m={M_input}
M3 N008 Vn_bias_casc N012 0 nch l={Ln_casc} w={Wn_casc} m={Mn_tail}
M4 N012 V_cm_fb 0 0 nch l={Ln_casc} w={Wn_casc} m={Mn_tail}
M10 Vo_n N006 N004 Vdd pch l={Lp_casc} w={Wp_casc} m={Mp_casc}
M11 Vo_n N009 N011 0 nch l={Ln_casc} w={Wn_casc} m={Mn_casc}
M12 N011 Vb_NMOS 0 0 nch l={Ln_casc} w={Wn_casc} m={Mn_casc}
V1 Vdd 0 1.8
M5 N004 N001 Vdd Vdd pch l={Lp_casc_top} w={Wp_casc_top} m={Mp_casc_top}
R1 N002 Vo_n 100Meg
R2 Vo_p N002 100Meg
M13 Vn_bias Vb_NMOS 0 0 nch l={Ln_casc} w={Wn_casc} m={Mn_tail}
I1 N001 Vb_NMOS 0.3m
M14 Vb_NMOS Vn_bias_casc Vn_bias 0 nch l={Ln_casc} w={Wn_casc} m={Mn_tail}
I2 N003 Vn_bias_casc 3m
M15 Vn_bias_casc Vn_bias_casc 0 0 nch l={Ln_casc} w={Wn_casc} m={Mn_tail}
M16 Vp_bias N001 Vdd Vdd pch l={Lp_casc_top} w={Wp_casc_top} m={Mp_casc_top}
M17 N001 N003 Vp_bias Vdd pch l={Lp_casc} w={Wp_casc} m={Mp_casc}
M18 N003 N003 Vdd Vdd pch l={Lp_casc} w={Wp_casc} m={Mp_casc_b}
M2 N005 Vin_n N008 0 nch l={L_input} w={W_input} m={M_input}
M6 Vo_p N007 N005 Vdd pch l={Lp_casc} w={Wp_casc} m={Mp_casc}
M7 Vo_p N010 N013 0 nch l={Ln_casc} w={Wn_Casc} m={Mn_casc}
M8 N013 Vb_NMOS 0 0 nch l={Ln_casc} w={Wn_Casc} m={Mn_casc}
M9 N005 N001 Vdd Vdd pch l={Lp_casc_top} w={Wp_casc_top} m={Mp_casc_top}
C2 Vb_NMOS 0 1000µ
C3 N014 0 15p
C4 Vo_n N014 1.5p
C6 N016 0 15p
C7 Vo_p N016 1.5p
V2 N015 0 {Vcm}
V4 Vin_p N015 PULSE(0 0.05) AC 0.5
V5 N015 Vin_n PULSE(0 0.05) AC 0.5
R3 N014 0 100Meg
R4 Vo_n N014 1G
R5 N016 0 100Meg
R6 Vo_p N016 1G
C1 Vo_n 0 {Cload}
C9 Vo_p 0 {Cload}
R7 N014 V_RC_p 10Meg
R8 V_RC_n N016 10Meg
C5 0 V_RC_p 1000µ
C8 V_RC_n 0 1000µ
C10 V_cm_fb 0 1000µ
V3 N002 V_cm_fb 0.38
C11 Vdd N001 1000µ
XX1 Vp_bias N004 N006 Vdd gb-nmos
XX2 Vp_bias N005 N007 Vdd gb-nmos
XX3 Vn_bias N013 N010 Vdd gb-pmos
XX4 Vn_bias N011 N009 Vdd gb-pmos
C12 0 N006 1p
C13 N007 0 1p

* block symbol definitions
.subckt gb-nmos Vin_p Vin_n Vout Vdd
M1 N003 Vin_p N007 0 nch l={L_input_GBN} w={W_input_GBN} m={M_input_GBN}
M3 N007 N008 N011 0 nch l={Ln_casc_GB_N} w={Wn_casc_GB_N} m={Mn_tail_GB_N}
M4 N011 Vb_Nmos 0 0 nch l={Ln_casc_GB_N} w={Wn_casc_GB_N} m={Mn_tail_GB_N}
M10 N006 N002 N003 Vdd pch l={Lp_casc_GB_N} w={Wp_casc_GB_N} m={Mp_casc_GB_N}
M11 N006 N008 N010 0 nch l={Ln_casc_GB_N} w={Wn_casc_GB_N} m={Mn_casc_GB_N}
M12 N010 N006 0 0 nch l={Ln_casc_GB_N} w={Wn_casc_GB_N} m={Mn_casc_GB_N}
M5 N003 N001 Vdd Vdd pch l={Lp_casc_top_GB_N} w={Wp_casc_top_GB_N} m={Mp_casc_top_GB_N}
M13 N009 Vb_Nmos 0 0 nch l={Ln_casc_GB_N} w={Wn_casc_GB_N} m={Mn_tail_GB_N}
I1 N001 Vb_Nmos 0.075m
M14 Vb_Nmos N008 N009 0 nch l={Ln_casc_GB_N} w={Wn_casc_GB_N} m={Mn_tail_GB_N}
I2 N002 N008 1.7m
M15 N008 N008 0 0 nch l={Ln_casc_GB_N} w={Wn_casc_GB_N} m={Mn_tail_GB_N}
M16 N005 N001 Vdd Vdd pch l={Lp_casc_top_GB_N} w={Wp_casc_top_GB_N} m={Mp_casc_top_GB_N}
M17 N001 N002 N005 Vdd pch l={Lp_casc_GB_N} w={Wp_casc_GB_N} m={Mp_casc_GB_N}
M18 N002 N002 Vdd Vdd pch l={Lp_casc_GB_N} w={Wp_casc_GB_N} m={Mp_casc_b_GB_N}
M2 N004 Vin_n N007 0 nch l={L_input_GBN} w={W_input_GBN} m={M_input_GBN}
M6 Vout N002 N004 Vdd pch l={Lp_casc_GB_N} w={Wp_casc_GB_N} m={Mp_casc_GB_N}
M7 Vout N008 N012 0 nch l={Ln_casc_GB_N} w={Wn_Casc_GB_N} m={Mn_casc_GB_N}
M8 N012 N006 0 0 nch l={Ln_casc_GB_N} w={Wn_Casc_GB_N} m={Mn_casc_GB_N}
M9 N004 N001 Vdd Vdd pch l={Lp_casc_top_GB_N} w={Wp_casc_top_GB_N} m={Mp_casc_top_GB_N}
C12 N001 Vdd 1000µ
.lib 'C:\Program Files (x86)\LTC\LTspiceIV\lib\cmp\log018.l' TT
.lib opamp.sub
.param Wn_casc_GB_N= 30u, Mn_casc_GB_N=3 , Ln_casc_GB_N=0.18u*Mn_casc_GB_N , Mn_tail_GB_N= Mn_casc_GB_N*2
.param Wp_casc_GB_N=39.7u, Mp_casc_GB_N = Mn_casc_GB_N*2,   Lp_casc_GB_N=0.18u*Mn_casc_GB_N
.param Wp_casc_top_GB_N=79.4u, Mp_casc_top_GB_N = Mn_casc_GB_N, Lp_casc_top_GB_N = 0.18u*Mn_casc_GB_N
* F(x) = 20*log10(abs(V(Vin_p,Vin_n)/1)+1n)
* Top PMOS dimensions (Current SOurce)
* PMOS Cascode Dimensions
* NMOS Cascode Dimensions - with Main M factor
.param Mp_casc_b_GB_N=Mp_casc_GB_N*2
.param W_input_GBN = 22u , L_input_GBN = 0.36u, M_input_GBN =1
.ends gb-nmos

.subckt gb-pmos Vin_p Vin_n Vout Vdd
M1 N001 N002 N003 N003 pch l={Lp_casc_GB} w={Wp_casc_GB} m={Mp_casc}
M2 N001 N012 N008 N008 nch l={Ln_casc_GB} w={Wn_casc_GB} m={Mn_casc}
M3 N008 N010 0 0 nch l={Ln_casc_GB} w={Wn_GB} m={Mn}
M4 N003 N001 Vdd Vdd pch l={Lp_casc_GB} w={Wp_casc_GB} m={Mp_casc}
I1 Vb_pcasc N010 0.075m
M5 N010 N012 N011 N011 nch l={Ln_casc_GB} w={Wn_casc_GB} m={Mn_casc}
I2 N002 N012 0.375m
M6 N006 Vb_pcasc Vdd_bias Vdd_bias pch l={Lp_casc_GB} w={Wp_casc_GB} m={M_tail}
M7 Vb_pcasc N002 N006 N006 pch l={Lp_casc_GB} w={Wp_casc_GB} m={M_tail}
M8 N002 N002 Vdd_bias Vdd_bias pch l={Lp_casc_GB} w={Wp_casc_GB} m={M_tail}
M9 Vout N002 N005 N005 pch l={Lp_casc_GB} w={Wp_casc_GB} m={Mp_casc}
M10 Vout N012 N009 N009 nch l={Ln_casc_GB} w={Wn_casc_GB} m={Mn_casc}
M11 N005 N001 Vdd Vdd pch l={Lp_casc_GB} w={Wp_casc_GB} m={Mp_casc}
M12 N007 N002 N004 N004 pch l={Lp_tail} w={Wp_casc_GB} m={M_tail}
M13 N009 Vin_n N007 N007 pch l={L_input_GBP} w={W_input_GBP} m={M_input_GBP}
M14 N008 Vin_p N007 N007 pch l={L_input_GBP} w={W_input_GBP} m={M_input_GBP}
C1 N010 0 1m
M15 N009 N010 0 0 nch l={Ln_casc_GB} w={Wn_GB} m={Mn}
M16 N011 N010 0 0 nch l={Ln_casc_GB} w={Wn_GB} m={Mn}
M17 N004 Vb_pcasc Vdd Vdd pch l={Lp_tail} w={Wp_casc_GB} m={M_tail}
M18 N012 N012 0 0 nch l={Ln_casc_GB} w={Wn_GB} m={Mn}
.lib 'C:\Program Files (x86)\LTC\LTspiceIV\lib\cmp\log018.l' TT
.lib opamp.sub
.param Wp_casc_GB=12.7u, Lp_casc_GB=0.36u*M_size Lp_tail=0.36u*M_size M_tail = M_size
.param Wn_casc_GB =1u, Ln_casc_GB= 0.36u*M_size Mn_casc=M_size
.param Wn_GB = Wn_casc_GB Ln_GB=0.36u*M_size Mn =2*M_size
.param W_input_GBP = 31u , L_input_GBP = 0.36u, M_input_GBP =4
.param M_size=3
.param Mp_casc=0.5*M_tail
.ends gb-pmos

.model NMOS NMOS
.model PMOS PMOS
.lib standard.mos
.lib 'C:\Program Files (x86)\LTC\LTspiceIV\lib\cmp\log018.l' TT
;tran 200n
.lib opamp.sub
;op
.ac dec 100 100 5G
.param Wn_casc= 55u, Mn_casc=1, Ln_casc=0.36u*Mn_casc , Mn_tail= Mn_casc*2
.param Wp_casc=52u, Mp_casc = Mn_casc*2, Lp_casc=0.36u*Mn_casc
.param Wp_casc_top=28u, Mp_casc_top = 7*Mn_casc, Lp_casc_top = 0.36u*Mn_casc
.param Vcm=0.90, Cload=1.5p
* F(x) = 20*log10(abs(V(Vin_p,Vin_n)/1)+1n)
* Top PMOS dimensions
* PMOS Cascode Dimensions
* NMOS Cascode Dimensions - with Main M factor
.param Mp_casc_b=Mp_casc*2
.param Aol = 80
* For open loop, short the left side of input capacitance. (Since Ideal Source)
* Aol of 80 will get 100db
.param W_input = 40u , L_input = 0.18u , M_input = 3
.backanno
.end